# Altium schematic sheet MIC24085.SchDoc: <title>
size C; Organization: Custom Embedded Solutions, LLC.; Address1: 130 Oakland Trace; Address2: Madison, AL 35758; DocumentNumber: <doc_num>; Revision: <Rev>; SheetNumber: 8; SheetTotal: 8; PageTitle: 12V Buck Regulator
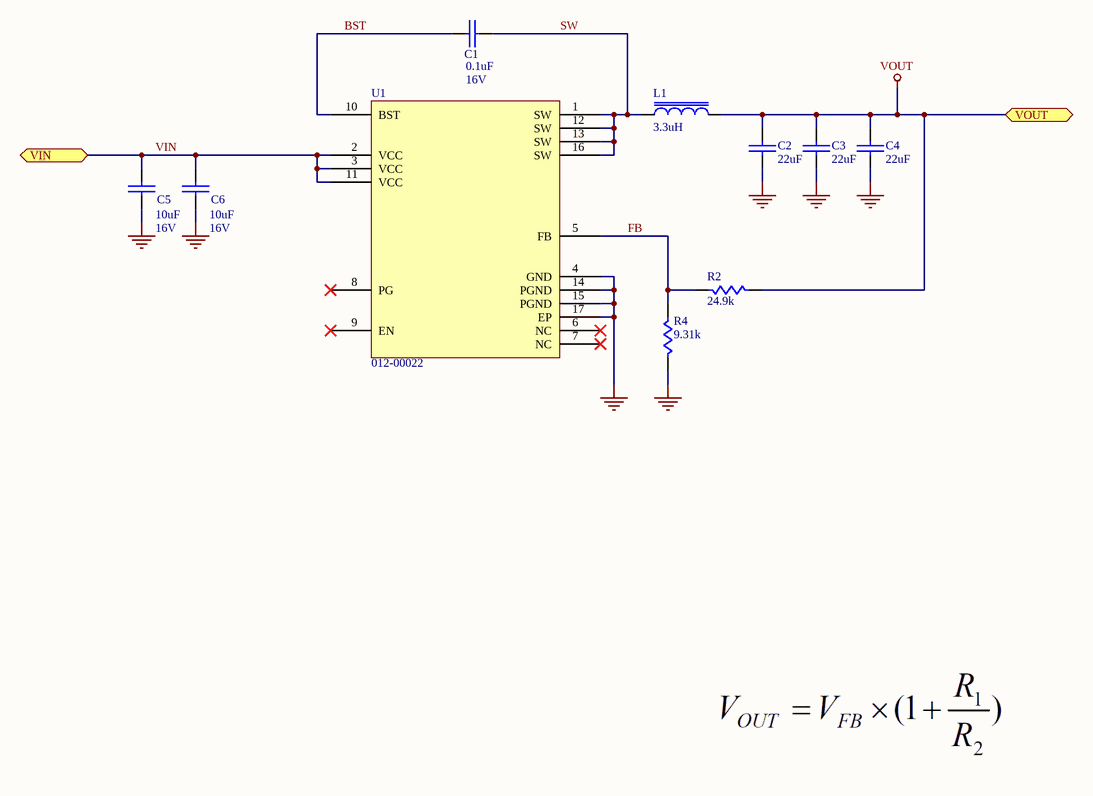
[diagram p0: MIC24085.SchDoc]

## Parts
C1  0.1uF  Voltage: 16V  [005-00008]
C2  22uF  [005-00003]
C3  22uF  [005-00003]
C4  22uF  [005-00003]
C5  10uF  Voltage: 16V  [005-00003]
C6  10uF  Voltage: 16V  [005-00003]
L1  3.3uH  [005-00012]
R2  24.9k  [005-00009]
R4  9.31k  [005-00009]
U1  Part Number: 012-00022  [005-00002]  (hidden comment: MIC24085)

## Ports
VIN, VOUT

## Nets
GND: C2.2 C3.2 C4.2 C5.2 C6.2 R4.2 U1.4(GND) U1.14(PGND) U1.15(PGND) U1.17(EP)
VOUT: C2.1 C3.1 C4.1 L1.2 R2.2 ; port VOUT
BST: C1.1 U1.10(BST)
FB: R2.1 R4.1 U1.5(FB)
SW: C1.2 L1.1 U1.1(SW) U1.12(SW) U1.13(SW) U1.16(SW)
VIN: C5.1 C6.1 U1.2(VCC) U1.3(VCC) U1.11(VCC) ; port VIN

Not connected (* = marked no-connect by the designer): U1 6(NC)* 7(NC)* 8(PG)* 9(EN)*

## Notes on the sheet
- Copyright (c)
- Page Title
- Design Title
- Creative Commons License, http://creativecommons.org/licenses/by/4.0/legalcode
  This PCB design by Custom Embedded Solutions, LLC. is licensed under a Creative Commons Attribution 4.0 International License.
- Size:
- Date:
- File:
- C
- Document Number:
- Time:
- Sheet
- Rev:
- of

## Library data of the parts
C1 = 011-00011: Capacitor 0.1uF 16V 10% 0402 X7R; 3rd Party: {Reference Design}; Manufacturer1: Kemet; Manufacturer1 Part Number: C0402C104K4RACT; Types: X1; Type: Ceramic; Part Number: 011-00011; Value: 0.1uF; Substrate: X7R; Package: 1005, EIA 0402, Chip Capacitor, 2-Leads, Body 1.00x0.50mm, IPC High Density
C2-C4 = 011-00004: CAP CER 22UF 6.3V X5R 20% 0805; Manufacturer1 Part Number: C2012X5R0J226M/1.25; Manufacturer1: TDK; Manufacturer2 Part Number: CL21A226KQQNNNF; Manufacturer3 Part Number: 08056D226MAT2A; 3rd Party: {Reference Design}; Type: Ceramic; Part Number: 011-00004; Voltage: 6.3V; Substrate: X5R; Manufacturer2: Samsung; Manufacturer3: AVX; Value: 22uF; Package: 2012, EIA 0805, Chip Capacitor, 2-Leads, Body 2.00x1.25mm, IPC High Density
C5 C6 = 011-00020: CAP CER 10UF 16V 10% X5R 0805; Manufacturer1: Samsung; Manufacturer1 Part Number: CL21A106KOQNNNF; Type: Ceramic; Preferred: Yes; Part Number: 011-00020; Value: 10uF; Substrate: X5R; Package: 2012, EIA 0805, Chip Capacitor, 2-Leads, Body 2.00x1.25mm, IPC High Density; Life Cycle: Maturity
L1 = 010-00005: INDUCTOR POWER 3.3UH 3A NR5030; Manufacturer1: Taiyo Yuden; Manufacturer1 Part Number: NRS5030T3R3MMGJ; Types: Power Transformer; Type: Power Inductor; Tolerance: 0.2; Saturation Current: 3.6A; DCR: 30mOhm; Shielded: Yes; Part Number: 010-00005; Value: 3.3uH; Current: 3A; Package: NR5030, Taiyo Yuden 5mmx5mm; Preferred: Yes
R2 = 009-00024: RES 24.9K OHM 1/10W 1% 0402 SMD; Manufacturer1 Part Number: ERJ-2RKF2492X; Manufacturer1: Panasonic; Tolerance: 0.01; Power: 1/16W; Part Number: 009-00024; Value: 24.9k; Package: 1005, EIA 0402, Chip Resistor, 2-Leads, Body 1.00x0.50mm, IPC High Density
R4 = 009-00030: RES 9.31K OHM 1/10W 1% 0402 SMD; Manufacturer1 Part Number: ERJ-2RKF9311X; Manufacturer1: Panasonic; Tolerance: 0.01; Power: 1/16W; Part Number: 009-00030; Value: 9.31k; Package: 1005, EIA 0402, Chip Resistor, 2-Leads, Body 1.00x0.50mm, IPC High Density
U1 = 012-00022: IC REG BUCK SYNC ADJ 3A 16QFN; Manufacturer1: Micrel; Manufacturer1 Part Number: MIC24085AYML; Preferred: Yes; Type: PMIC; Value: MIC24085; Package: QFN, 16-Leads, Body 3.00x3.00mm, Pitch 0.50mm, Thermal Pad 1.70x1.70mm, IPC High Density; Life Cycle: Growth